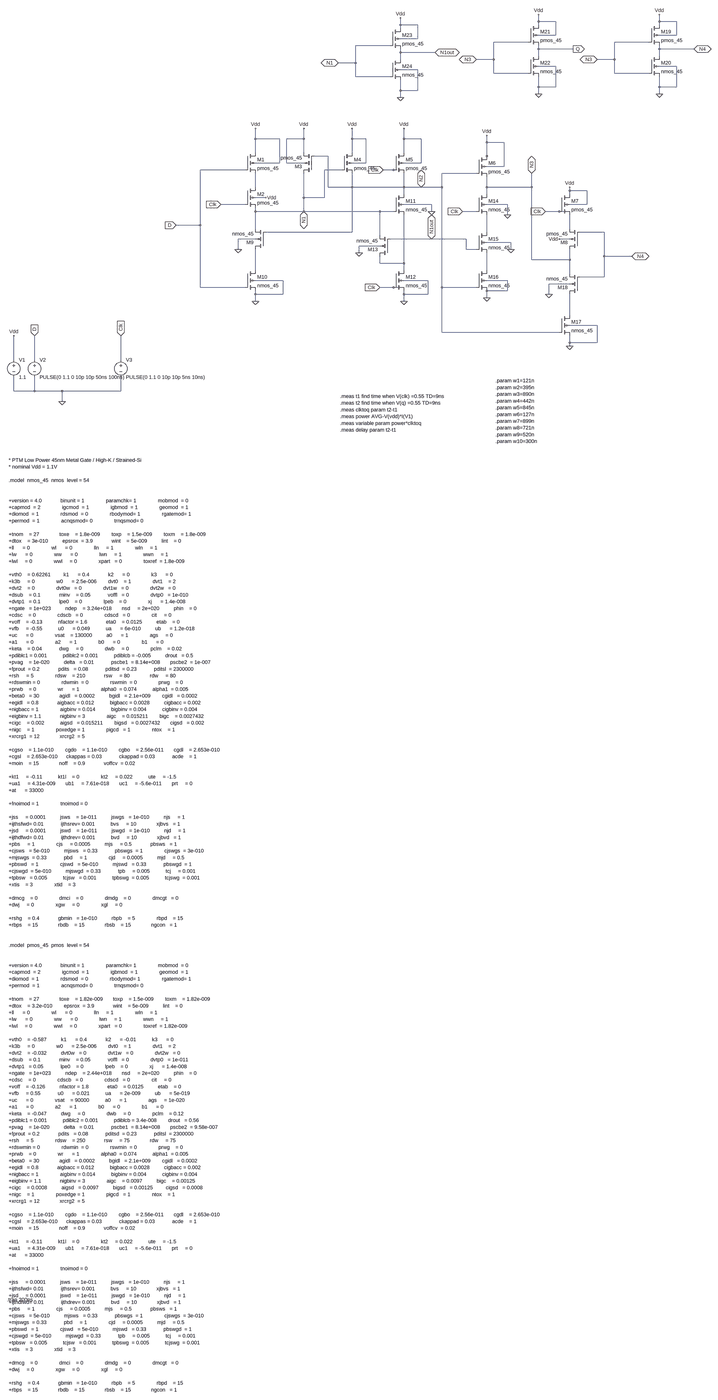
[diagram p0: schematic s2cff.asc, whole sheet]
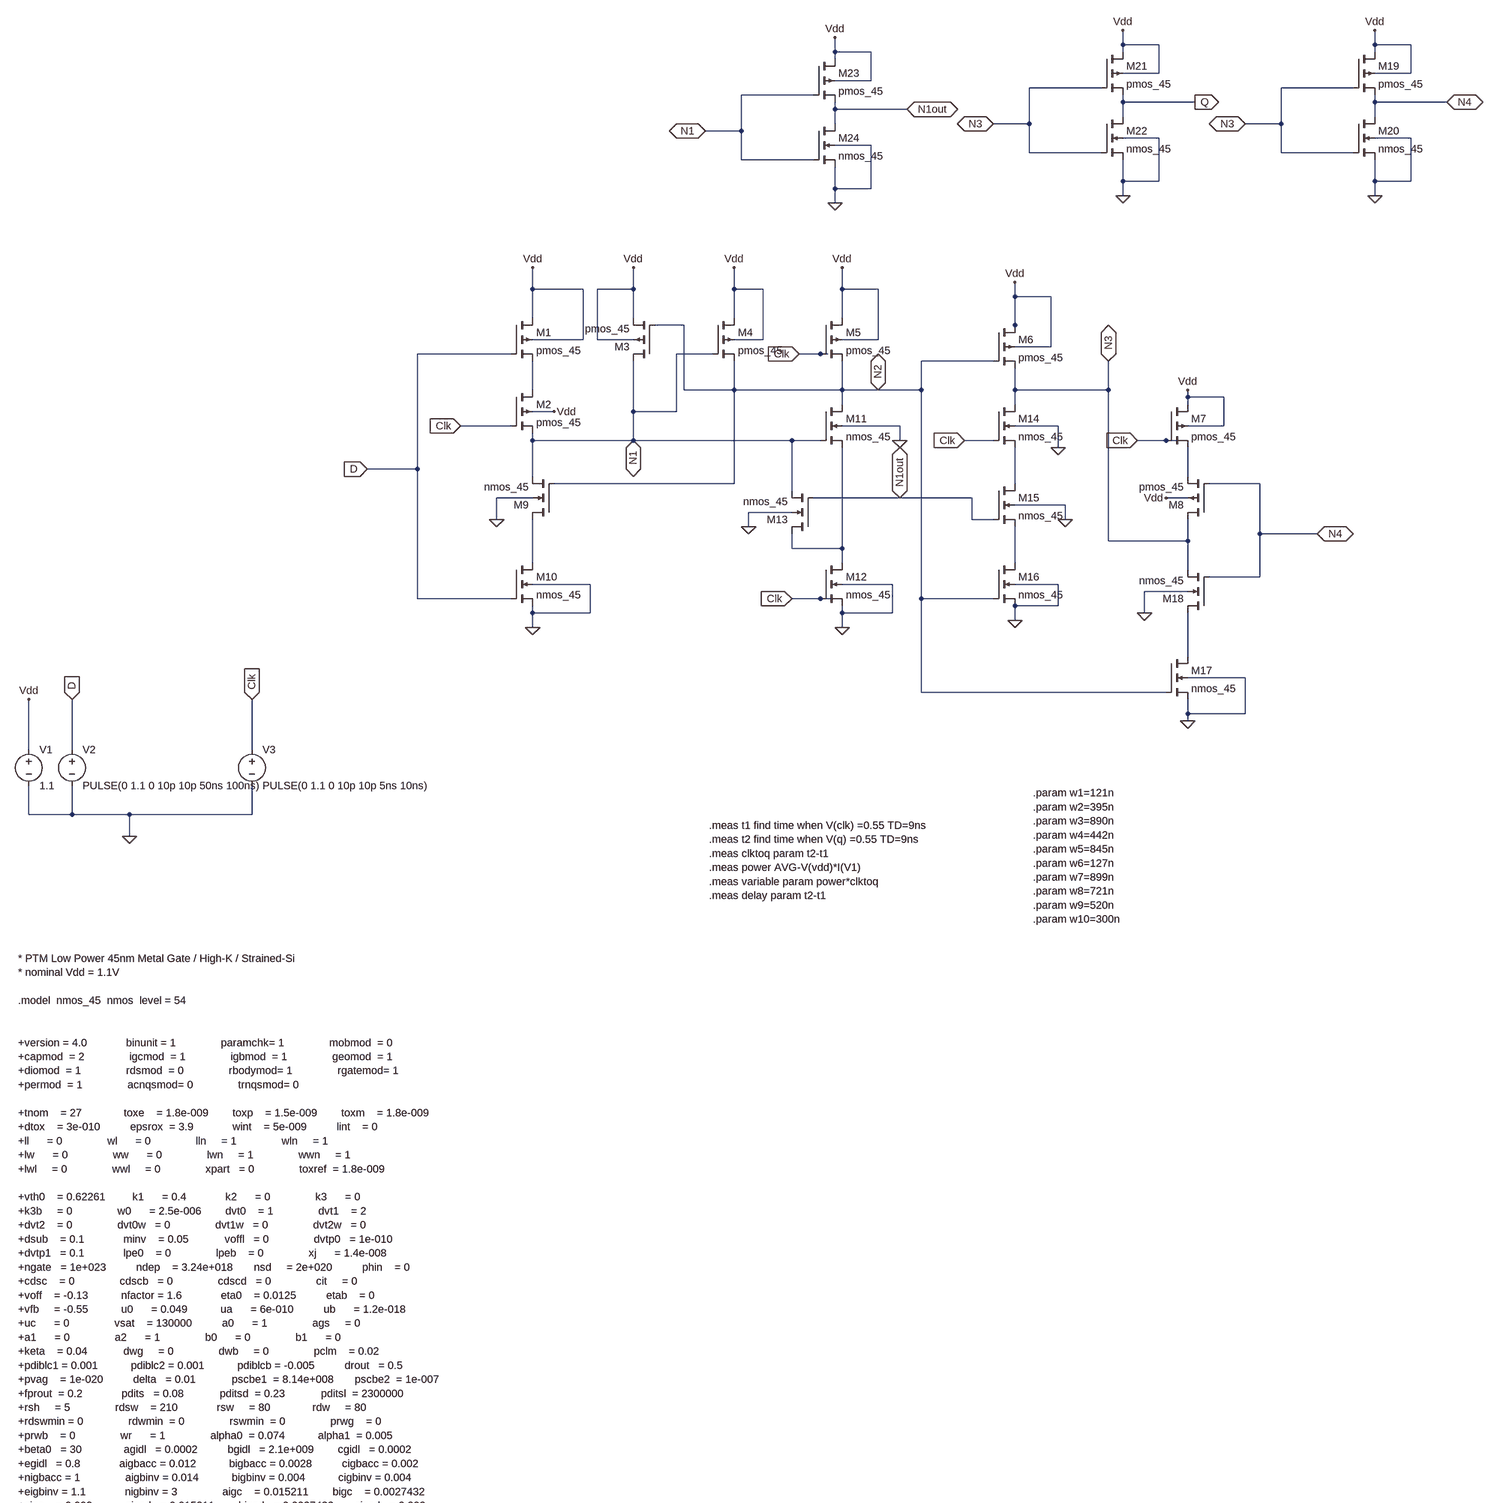
[diagram p1: schematic s2cff.asc, part, row 1 of 2, column 1 of 1]
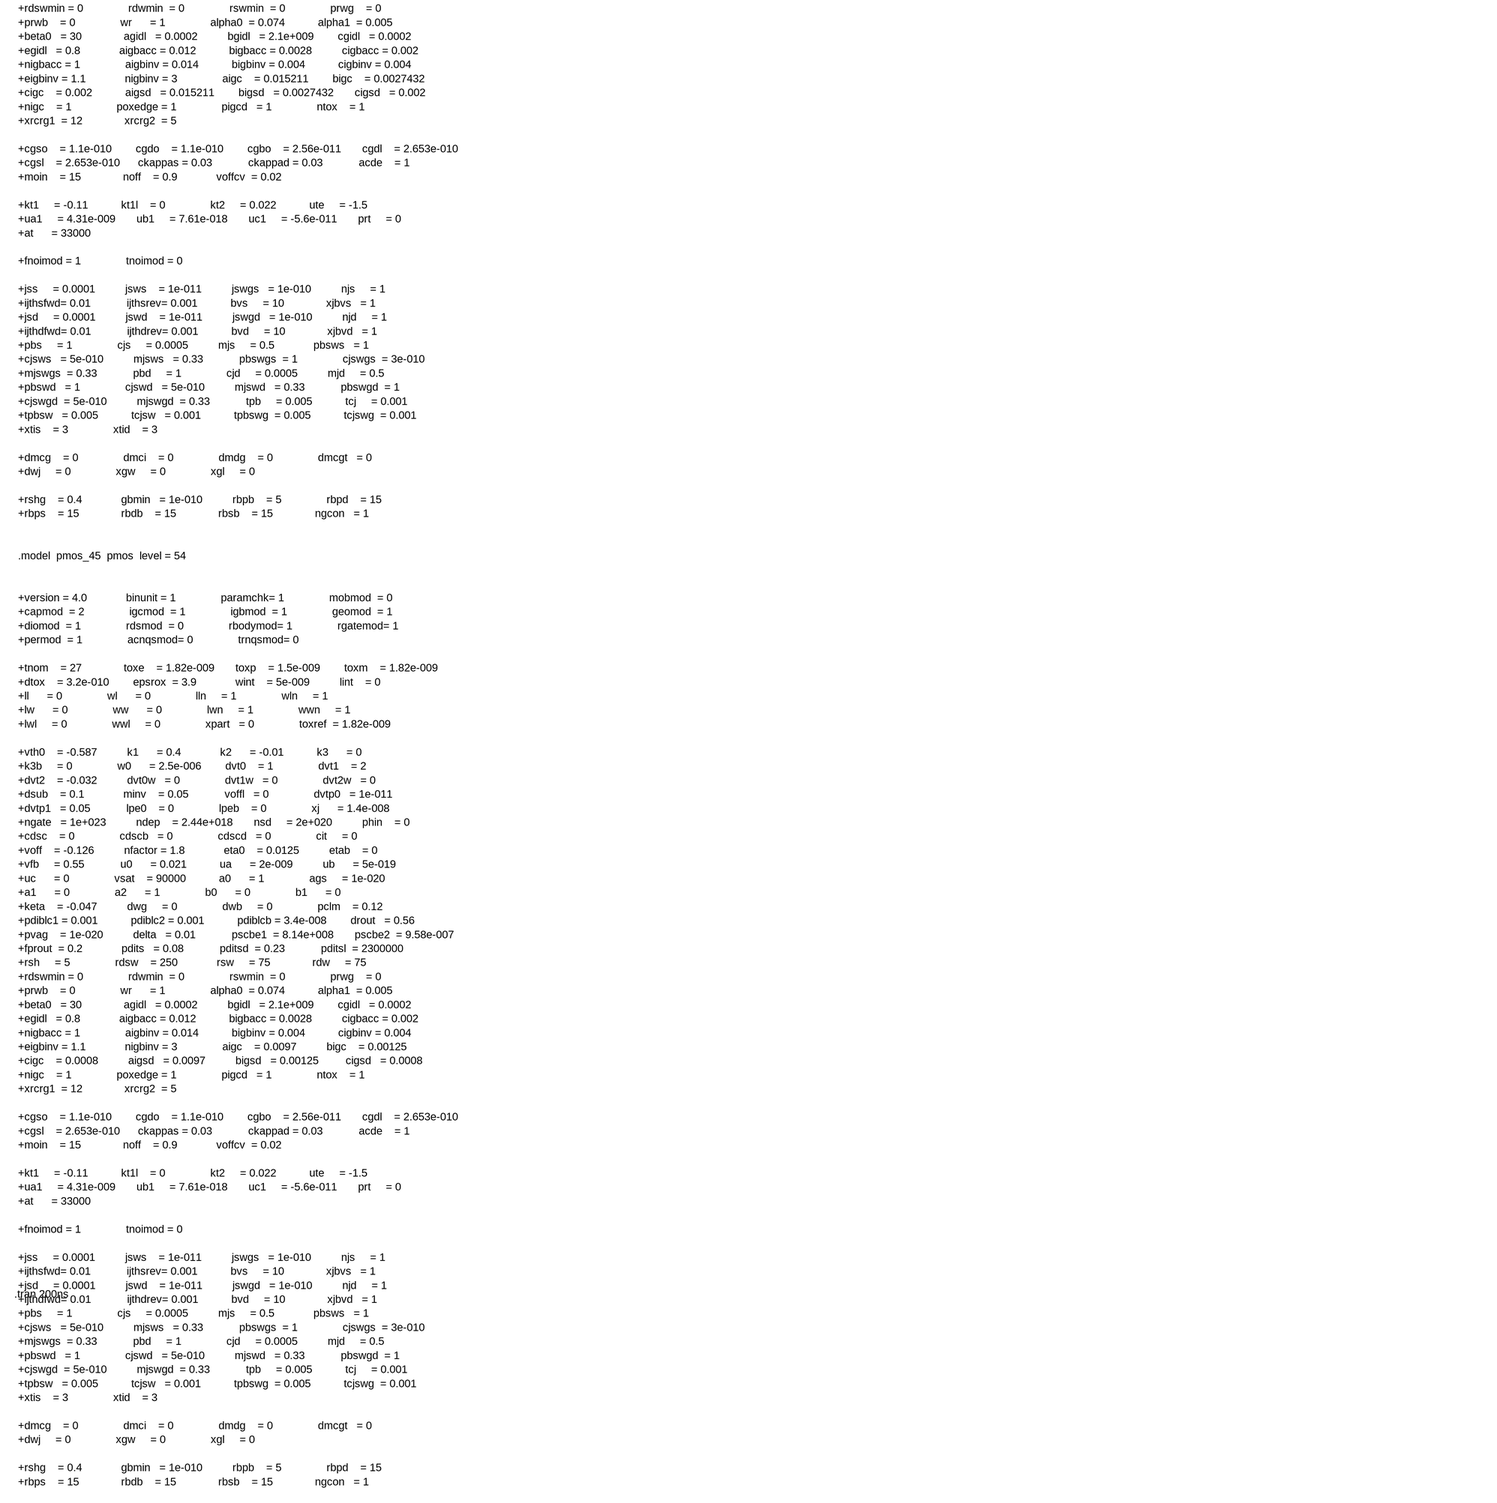
[diagram p2: schematic s2cff.asc, part, row 2 of 2, column 1 of 1]
s2cff.asc, the LTspice schematic file:
Version 4
SHEET 1 4284 5184
WIRE 1760 -752 1760 -784
WIRE 1840 -752 1760 -752
WIRE 2320 -752 2320 -784
WIRE 2400 -752 2320 -752
WIRE 1120 -736 1120 -768
WIRE 1200 -736 1120 -736
WIRE 1760 -736 1760 -752
WIRE 2320 -736 2320 -752
WIRE 1120 -720 1120 -736
WIRE 1840 -688 1840 -752
WIRE 1840 -688 1760 -688
WIRE 2400 -688 2400 -752
WIRE 2400 -688 2320 -688
WIRE 1200 -672 1200 -736
WIRE 1200 -672 1120 -672
WIRE 1712 -656 1552 -656
WIRE 2272 -656 2112 -656
WIRE 1072 -640 912 -640
WIRE 1760 -624 1760 -640
WIRE 1920 -624 1760 -624
WIRE 2320 -624 2320 -640
WIRE 2480 -624 2320 -624
WIRE 1120 -608 1120 -624
WIRE 1280 -608 1120 -608
WIRE 1760 -592 1760 -624
WIRE 2320 -592 2320 -624
WIRE 1120 -576 1120 -608
WIRE 1552 -576 1552 -656
WIRE 1552 -576 1472 -576
WIRE 2112 -576 2112 -656
WIRE 2112 -576 2032 -576
WIRE 912 -560 912 -640
WIRE 912 -560 832 -560
WIRE 1840 -544 1760 -544
WIRE 2400 -544 2320 -544
WIRE 1200 -528 1120 -528
WIRE 1552 -512 1552 -576
WIRE 1712 -512 1552 -512
WIRE 2112 -512 2112 -576
WIRE 2272 -512 2112 -512
WIRE 912 -496 912 -560
WIRE 1072 -496 912 -496
WIRE 1760 -448 1760 -496
WIRE 1840 -448 1840 -544
WIRE 1840 -448 1760 -448
WIRE 2320 -448 2320 -496
WIRE 2400 -448 2400 -544
WIRE 2400 -448 2320 -448
WIRE 1120 -432 1120 -480
WIRE 1200 -432 1200 -528
WIRE 1200 -432 1120 -432
WIRE 1760 -416 1760 -448
WIRE 2320 -416 2320 -448
WIRE 1120 -400 1120 -432
WIRE 448 -208 448 -256
WIRE 560 -208 448 -208
WIRE 672 -208 672 -256
WIRE 672 -208 592 -208
WIRE 896 -208 896 -256
WIRE 960 -208 896 -208
WIRE 1136 -208 1136 -256
WIRE 1216 -208 1136 -208
WIRE 1520 -192 1520 -224
WIRE 1600 -192 1520 -192
WIRE 448 -144 448 -208
WIRE 672 -144 672 -208
WIRE 896 -144 896 -208
WIRE 1136 -144 1136 -208
WIRE 784 -128 720 -128
WIRE 1520 -128 1520 -192
WIRE 1520 -112 1520 -128
WIRE 560 -96 560 -208
WIRE 560 -96 448 -96
WIRE 592 -96 592 -208
WIRE 672 -96 592 -96
WIRE 960 -96 960 -208
WIRE 960 -96 896 -96
WIRE 1216 -96 1216 -208
WIRE 1216 -96 1136 -96
WIRE 1600 -80 1600 -192
WIRE 1600 -80 1520 -80
WIRE 400 -64 192 -64
WIRE 848 -64 768 -64
WIRE 1088 -64 1040 -64
WIRE 1104 -64 1088 -64
WIRE 1472 -48 1312 -48
WIRE 448 16 448 -48
WIRE 784 16 784 -128
WIRE 896 16 896 -48
WIRE 896 16 784 16
WIRE 1136 16 1136 -48
WIRE 1136 16 896 16
WIRE 1216 16 1136 16
WIRE 1312 16 1312 -48
WIRE 1312 16 1216 16
WIRE 1520 16 1520 -32
WIRE 1728 16 1728 -48
WIRE 1728 16 1520 16
WIRE 1904 32 1904 16
WIRE 1984 32 1904 32
WIRE 1136 48 1136 16
WIRE 1520 48 1520 16
WIRE 1904 48 1904 32
WIRE 496 64 448 64
WIRE 672 64 672 -48
WIRE 768 64 768 -64
WIRE 768 64 672 64
WIRE 400 96 288 96
WIRE 1264 96 1136 96
WIRE 1616 96 1520 96
WIRE 1984 96 1984 32
WIRE 1984 96 1904 96
WIRE 448 128 448 112
WIRE 672 128 672 64
WIRE 672 128 448 128
WIRE 1024 128 672 128
WIRE 1088 128 1024 128
WIRE 1264 128 1264 96
WIRE 1472 128 1408 128
WIRE 1856 128 1792 128
WIRE 1904 128 1856 128
WIRE 1616 144 1616 96
WIRE 192 192 192 -64
WIRE 192 192 80 192
WIRE 448 208 448 128
WIRE 1904 208 1904 144
WIRE 896 224 896 16
WIRE 896 224 496 224
WIRE 1520 224 1520 144
WIRE 2064 224 1952 224
WIRE 1024 240 1024 128
WIRE 448 256 368 256
WIRE 1264 256 1072 256
WIRE 1424 256 1264 256
WIRE 1904 256 1856 256
WIRE 1632 272 1520 272
WIRE 1024 288 928 288
WIRE 368 304 368 256
WIRE 1424 304 1424 256
WIRE 1472 304 1424 304
WIRE 1632 304 1632 272
WIRE 928 320 928 288
WIRE 2064 336 2064 224
WIRE 2192 336 2064 336
WIRE 1728 352 1728 16
WIRE 1904 352 1904 304
WIRE 1904 352 1728 352
WIRE 1024 368 1024 336
WIRE 1136 368 1136 144
WIRE 1136 368 1024 368
WIRE 448 400 448 304
WIRE 1136 400 1136 368
WIRE 1520 400 1520 320
WIRE 1904 416 1904 352
WIRE 2064 432 2064 336
WIRE 2064 432 1952 432
WIRE 576 448 448 448
WIRE 1248 448 1136 448
WIRE 1616 448 1520 448
WIRE 1904 464 1808 464
WIRE 192 480 192 192
WIRE 400 480 192 480
WIRE 1088 480 1024 480
WIRE 1136 480 1088 480
WIRE 1312 480 1312 16
WIRE 1472 480 1312 480
WIRE 1616 496 1616 448
WIRE 1616 496 1520 496
WIRE 448 512 448 496
WIRE 576 512 576 448
WIRE 576 512 448 512
WIRE 1136 512 1136 496
WIRE 1248 512 1248 448
WIRE 1248 512 1136 512
WIRE 1808 512 1808 464
WIRE 1520 528 1520 496
WIRE 448 544 448 512
WIRE 1136 544 1136 512
WIRE 1904 608 1904 512
WIRE 2032 656 1904 656
WIRE 1312 688 1312 480
WIRE 1856 688 1312 688
WIRE 1904 736 1904 704
WIRE 2032 736 2032 656
WIRE 2032 736 1904 736
WIRE 1904 752 1904 736
WIRE -672 816 -672 704
WIRE -576 816 -576 704
WIRE -176 816 -176 704
WIRE -672 960 -672 896
WIRE -576 960 -576 896
WIRE -576 960 -672 960
WIRE -448 960 -576 960
WIRE -176 960 -176 896
WIRE -176 960 -448 960
WIRE -448 1008 -448 960
FLAG -576 704 D
IOPIN -576 704 In
FLAG -176 704 Clk
IOPIN -176 704 In
FLAG -672 704 Vdd
FLAG -448 1008 0
FLAG 1760 -784 Vdd
FLAG 1760 -416 0
FLAG 448 -256 Vdd
FLAG 672 -256 Vdd
FLAG 896 -256 Vdd
FLAG 1136 -256 Vdd
FLAG 1520 -224 Vdd
FLAG 80 192 D
IOPIN 80 192 In
FLAG 288 96 Clk
IOPIN 288 96 In
FLAG 1472 -576 N3
IOPIN 1472 -576 BiDir
FLAG 1920 -624 Q
IOPIN 1920 -624 Out
FLAG 1904 16 Vdd
FLAG 448 544 0
FLAG 1136 544 0
FLAG 1904 752 0
FLAG 2320 -784 Vdd
FLAG 2320 -416 0
FLAG 2032 -576 N3
IOPIN 2032 -576 BiDir
FLAG 2480 -624 N4
IOPIN 2480 -624 BiDir
FLAG 1728 -48 N3
IOPIN 1728 -48 BiDir
FLAG 2192 336 N4
IOPIN 2192 336 BiDir
FLAG 1792 128 Clk
IOPIN 1792 128 In
FLAG 1408 128 Clk
IOPIN 1408 128 In
FLAG 1040 -64 Clk
IOPIN 1040 -64 In
FLAG 672 128 N1
IOPIN 672 128 BiDir
FLAG 1216 16 N2
IOPIN 1216 16 BiDir
FLAG 1120 -768 Vdd
FLAG 1120 -400 0
FLAG 832 -560 N1
IOPIN 832 -560 BiDir
FLAG 1280 -608 N1out
IOPIN 1280 -608 BiDir
FLAG 1264 256 N1out
IOPIN 1264 256 BiDir
FLAG 1024 480 Clk
IOPIN 1024 480 In
FLAG 1520 528 0
FLAG 368 304 0
FLAG 928 320 0
FLAG 1264 128 0
FLAG 1616 144 0
FLAG 1632 304 0
FLAG 1808 512 0
FLAG 1856 256 Vdd
FLAG 496 64 Vdd
SYMBOL voltage -672 800 R0
WINDOW 123 0 0 Left 0
WINDOW 39 0 0 Left 0
SYMATTR InstName V1
SYMATTR Value 1.1
SYMBOL voltage -576 800 R0
WINDOW 123 0 0 Left 0
WINDOW 39 0 0 Left 0
SYMATTR InstName V2
SYMATTR Value PULSE(0 1.1 0 10p 10p 50ns 100ns)
SYMBOL voltage -176 800 R0
WINDOW 123 0 0 Left 0
WINDOW 39 0 0 Left 0
SYMATTR InstName V3
SYMATTR Value PULSE(0 1.1 0 10p 10p 5ns 10ns)
SYMBOL pmos4 400 -144 R0
SYMATTR InstName M1
SYMATTR Value pmos_45
SYMATTR Value2 l=45n w=180n
SYMBOL pmos4 400 16 R0
SYMATTR InstName M2
SYMATTR Value pmos_45
SYMATTR Value2 l=45n w=180n
SYMBOL pmos4 720 -48 R180
SYMATTR InstName M3
SYMATTR Value pmos_45
SYMATTR Value2 l=45n w=180n
SYMBOL pmos4 848 -144 R0
SYMATTR InstName M4
SYMATTR Value pmos_45
SYMATTR Value2 l=45n w=180n
SYMBOL pmos4 1088 -144 R0
SYMATTR InstName M5
SYMATTR Value pmos_45
SYMATTR Value2 l=45n w=180n
SYMBOL pmos4 1472 -128 R0
SYMATTR InstName M6
SYMATTR Value pmos_45
SYMATTR Value2 l=45n w=180n
SYMBOL pmos4 1856 48 R0
SYMATTR InstName M7
SYMATTR Value pmos_45
SYMATTR Value2 l=45n w=180n
SYMBOL pmos4 1952 304 R180
SYMATTR InstName M8
SYMATTR Value pmos_45
SYMATTR Value2 l=45n w=180n
SYMBOL nmos4 400 400 R0
SYMATTR InstName M10
SYMATTR Value nmos_45
SYMATTR Value2 l=45n w={w2}
SYMBOL nmos4 1088 48 R0
SYMATTR InstName M11
SYMATTR Value nmos_45
SYMATTR Value2 l=45n w={w3}
SYMBOL nmos4 1088 400 R0
SYMATTR InstName M12
SYMATTR Value nmos_45
SYMATTR Value2 l=45n w={w5}
SYMBOL nmos4 1072 336 R180
SYMATTR InstName M13
SYMATTR Value nmos_45
SYMATTR Value2 l=45n w={w4}
SYMBOL nmos4 1472 48 R0
SYMATTR InstName M14
SYMATTR Value nmos_45
SYMATTR Value2 l=45n w={w6}
SYMBOL nmos4 1472 224 R0
SYMATTR InstName M15
SYMATTR Value nmos_45
SYMATTR Value2 l=45n w={w7}
SYMBOL nmos4 1472 400 R0
SYMATTR InstName M16
SYMATTR Value nmos_45
SYMATTR Value2 l=45n w={w8}
SYMBOL nmos4 1856 608 R0
SYMATTR InstName M17
SYMATTR Value nmos_45
SYMATTR Value2 l=45n w={w10}
SYMBOL nmos4 1952 512 R180
SYMATTR InstName M18
SYMATTR Value nmos_45
SYMATTR Value2 l=45n w={w9}
SYMBOL pmos4 1712 -736 R0
SYMATTR InstName M21
SYMATTR Value pmos_45
SYMATTR Value2 l=45n w=180n
SYMBOL nmos4 1712 -592 R0
SYMATTR InstName M22
SYMATTR Value nmos_45
SYMATTR Value2 l=45n w=90n
SYMBOL nmos4 496 304 R180
SYMATTR InstName M9
SYMATTR Value nmos_45
SYMATTR Value2 l=45n w={w1}
SYMBOL pmos4 2272 -736 R0
SYMATTR InstName M19
SYMATTR Value pmos_45
SYMATTR Value2 l=45n w=180n
SYMBOL nmos4 2272 -592 R0
SYMATTR InstName M20
SYMATTR Value nmos_45
SYMATTR Value2 l=45n w=90n
SYMBOL pmos4 1072 -720 R0
SYMATTR InstName M23
SYMATTR Value pmos_45
SYMATTR Value2 l=45n w=180n
SYMBOL nmos4 1072 -576 R0
SYMATTR InstName M24
SYMATTR Value nmos_45
SYMATTR Value2 l=45n w=90n
TEXT -696 1280 Left 2 !* PTM Low Power 45nm Metal Gate / High-K / Strained-Si\n* nominal Vdd = 1.1V\n \n.model  nmos_45  nmos  level = 54\n \n \n+version = 4.0             binunit = 1               paramchk= 1               mobmod  = 0             \n+capmod  = 2               igcmod  = 1               igbmod  = 1               geomod  = 1             \n+diomod  = 1               rdsmod  = 0               rbodymod= 1               rgatemod= 1             \n+permod  = 1               acnqsmod= 0               trnqsmod= 0             \n \n+tnom    = 27              toxe    = 1.8e-009        toxp    = 1.5e-009        toxm    = 1.8e-009      \n+dtox    = 3e-010          epsrox  = 3.9             wint    = 5e-009          lint    = 0             \n+ll      = 0               wl      = 0               lln     = 1               wln     = 1             \n+lw      = 0               ww      = 0               lwn     = 1               wwn     = 1             \n+lwl     = 0               wwl     = 0               xpart   = 0               toxref  = 1.8e-009      \n \n+vth0    = 0.62261         k1      = 0.4             k2      = 0               k3      = 0             \n+k3b     = 0               w0      = 2.5e-006        dvt0    = 1               dvt1    = 2             \n+dvt2    = 0               dvt0w   = 0               dvt1w   = 0               dvt2w   = 0             \n+dsub    = 0.1             minv    = 0.05            voffl   = 0               dvtp0   = 1e-010        \n+dvtp1   = 0.1             lpe0    = 0               lpeb    = 0               xj      = 1.4e-008      \n+ngate   = 1e+023          ndep    = 3.24e+018       nsd     = 2e+020          phin    = 0             \n+cdsc    = 0               cdscb   = 0               cdscd   = 0               cit     = 0             \n+voff    = -0.13           nfactor = 1.6             eta0    = 0.0125          etab    = 0             \n+vfb     = -0.55           u0      = 0.049           ua      = 6e-010          ub      = 1.2e-018      \n+uc      = 0               vsat    = 130000          a0      = 1               ags     = 0             \n+a1      = 0               a2      = 1               b0      = 0               b1      = 0             \n+keta    = 0.04            dwg     = 0               dwb     = 0               pclm    = 0.02          \n+pdiblc1 = 0.001           pdiblc2 = 0.001           pdiblcb = -0.005          drout   = 0.5           \n+pvag    = 1e-020          delta   = 0.01            pscbe1  = 8.14e+008       pscbe2  = 1e-007        \n+fprout  = 0.2             pdits   = 0.08            pditsd  = 0.23            pditsl  = 2300000       \n+rsh     = 5               rdsw    = 210             rsw     = 80              rdw     = 80            \n+rdswmin = 0               rdwmin  = 0               rswmin  = 0               prwg    = 0             \n+prwb    = 0               wr      = 1               alpha0  = 0.074           alpha1  = 0.005         \n+beta0   = 30              agidl   = 0.0002          bgidl   = 2.1e+009        cgidl   = 0.0002        \n+egidl   = 0.8             aigbacc = 0.012           bigbacc = 0.0028          cigbacc = 0.002         \n+nigbacc = 1               aigbinv = 0.014           bigbinv = 0.004           cigbinv = 0.004         \n+eigbinv = 1.1             nigbinv = 3               aigc    = 0.015211        bigc    = 0.0027432     \n+cigc    = 0.002           aigsd   = 0.015211        bigsd   = 0.0027432       cigsd   = 0.002         \n+nigc    = 1               poxedge = 1               pigcd   = 1               ntox    = 1             \n+xrcrg1  = 12              xrcrg2  = 5             \n \n+cgso    = 1.1e-010        cgdo    = 1.1e-010        cgbo    = 2.56e-011       cgdl    = 2.653e-010    \n+cgsl    = 2.653e-010      ckappas = 0.03            ckappad = 0.03            acde    = 1             \n+moin    = 15              noff    = 0.9             voffcv  = 0.02          \n \n+kt1     = -0.11           kt1l    = 0               kt2     = 0.022           ute     = -1.5          \n+ua1     = 4.31e-009       ub1     = 7.61e-018       uc1     = -5.6e-011       prt     = 0             \n+at      = 33000         \n \n+fnoimod = 1               tnoimod = 0             \n \n+jss     = 0.0001          jsws    = 1e-011          jswgs   = 1e-010          njs     = 1             \n+ijthsfwd= 0.01            ijthsrev= 0.001           bvs     = 10              xjbvs   = 1             \n+jsd     = 0.0001          jswd    = 1e-011          jswgd   = 1e-010          njd     = 1             \n+ijthdfwd= 0.01            ijthdrev= 0.001           bvd     = 10              xjbvd   = 1             \n+pbs     = 1               cjs     = 0.0005          mjs     = 0.5             pbsws   = 1             \n+cjsws   = 5e-010          mjsws   = 0.33            pbswgs  = 1               cjswgs  = 3e-010        \n+mjswgs  = 0.33            pbd     = 1               cjd     = 0.0005          mjd     = 0.5           \n+pbswd   = 1               cjswd   = 5e-010          mjswd   = 0.33            pbswgd  = 1             \n+cjswgd  = 5e-010          mjswgd  = 0.33            tpb     = 0.005           tcj     = 0.001         \n+tpbsw   = 0.005           tcjsw   = 0.001           tpbswg  = 0.005           tcjswg  = 0.001         \n+xtis    = 3               xtid    = 3             \n \n+dmcg    = 0               dmci    = 0               dmdg    = 0               dmcgt   = 0             \n+dwj     = 0               xgw     = 0               xgl     = 0             \n \n+rshg    = 0.4             gbmin   = 1e-010          rbpb    = 5               rbpd    = 15            \n+rbps    = 15              rbdb    = 15              rbsb    = 15              ngcon   = 1             \n \n \n.model  pmos_45  pmos  level = 54\n \n \n+version = 4.0             binunit = 1               paramchk= 1               mobmod  = 0             \n+capmod  = 2               igcmod  = 1               igbmod  = 1               geomod  = 1             \n+diomod  = 1               rdsmod  = 0               rbodymod= 1               rgatemod= 1             \n+permod  = 1               acnqsmod= 0               trnqsmod= 0             \n \n+tnom    = 27              toxe    = 1.82e-009       toxp    = 1.5e-009        toxm    = 1.82e-009     \n+dtox    = 3.2e-010        epsrox  = 3.9             wint    = 5e-009          lint    = 0             \n+ll      = 0               wl      = 0               lln     = 1               wln     = 1             \n+lw      = 0               ww      = 0               lwn     = 1               wwn     = 1             \n+lwl     = 0               wwl     = 0               xpart   = 0               toxref  = 1.82e-009     \n \n+vth0    = -0.587          k1      = 0.4             k2      = -0.01           k3      = 0             \n+k3b     = 0               w0      = 2.5e-006        dvt0    = 1               dvt1    = 2             \n+dvt2    = -0.032          dvt0w   = 0               dvt1w   = 0               dvt2w   = 0             \n+dsub    = 0.1             minv    = 0.05            voffl   = 0               dvtp0   = 1e-011        \n+dvtp1   = 0.05            lpe0    = 0               lpeb    = 0               xj      = 1.4e-008      \n+ngate   = 1e+023          ndep    = 2.44e+018       nsd     = 2e+020          phin    = 0             \n+cdsc    = 0               cdscb   = 0               cdscd   = 0               cit     = 0             \n+voff    = -0.126          nfactor = 1.8             eta0    = 0.0125          etab    = 0             \n+vfb     = 0.55            u0      = 0.021           ua      = 2e-009          ub      = 5e-019        \n+uc      = 0               vsat    = 90000           a0      = 1               ags     = 1e-020        \n+a1      = 0               a2      = 1               b0      = 0               b1      = 0             \n+keta    = -0.047          dwg     = 0               dwb     = 0               pclm    = 0.12          \n+pdiblc1 = 0.001           pdiblc2 = 0.001           pdiblcb = 3.4e-008        drout   = 0.56          \n+pvag    = 1e-020          delta   = 0.01            pscbe1  = 8.14e+008       pscbe2  = 9.58e-007     \n+fprout  = 0.2             pdits   = 0.08            pditsd  = 0.23            pditsl  = 2300000       \n+rsh     = 5               rdsw    = 250             rsw     = 75              rdw     = 75            \n+rdswmin = 0               rdwmin  = 0               rswmin  = 0               prwg    = 0             \n+prwb    = 0               wr      = 1               alpha0  = 0.074           alpha1  = 0.005         \n+beta0   = 30              agidl   = 0.0002          bgidl   = 2.1e+009        cgidl   = 0.0002        \n+egidl   = 0.8             aigbacc = 0.012           bigbacc = 0.0028          cigbacc = 0.002         \n+nigbacc = 1               aigbinv = 0.014           bigbinv = 0.004           cigbinv = 0.004         \n+eigbinv = 1.1             nigbinv = 3               aigc    = 0.0097          bigc    = 0.00125       \n+cigc    = 0.0008          aigsd   = 0.0097          bigsd   = 0.00125         cigsd   = 0.0008        \n+nigc    = 1               poxedge = 1               pigcd   = 1               ntox    = 1             \n+xrcrg1  = 12              xrcrg2  = 5             \n \n+cgso    = 1.1e-010        cgdo    = 1.1e-010        cgbo    = 2.56e-011       cgdl    = 2.653e-010    \n+cgsl    = 2.653e-010      ckappas = 0.03            ckappad = 0.03            acde    = 1             \n+moin    = 15              noff    = 0.9             voffcv  = 0.02          \n \n+kt1     = -0.11           kt1l    = 0               kt2     = 0.022           ute     = -1.5          \n+ua1     = 4.31e-009       ub1     = 7.61e-018       uc1     = -5.6e-011       prt     = 0             \n+at      = 33000         \n \n+fnoimod = 1               tnoimod = 0             \n \n+jss     = 0.0001          jsws    = 1e-011          jswgs   = 1e-010          njs     = 1             \n+ijthsfwd= 0.01            ijthsrev= 0.001           bvs     = 10              xjbvs   = 1             \n+jsd     = 0.0001          jswd    = 1e-011          jswgd   = 1e-010          njd     = 1             \n+ijthdfwd= 0.01            ijthdrev= 0.001           bvd     = 10              xjbvd   = 1             \n+pbs     = 1               cjs     = 0.0005          mjs     = 0.5             pbsws   = 1             \n+cjsws   = 5e-010          mjsws   = 0.33            pbswgs  = 1               cjswgs  = 3e-010        \n+mjswgs  = 0.33            pbd     = 1               cjd     = 0.0005          mjd     = 0.5           \n+pbswd   = 1               cjswd   = 5e-010          mjswd   = 0.33            pbswgd  = 1             \n+cjswgd  = 5e-010          mjswgd  = 0.33            tpb     = 0.005           tcj     = 0.001         \n+tpbsw   = 0.005           tcjsw   = 0.001           tpbswg  = 0.005           tcjswg  = 0.001         \n+xtis    = 3               xtid    = 3             \n \n+dmcg    = 0               dmci    = 0               dmdg    = 0               dmcgt   = 0             \n+dwj     = 0               xgw     = 0               xgl     = 0             \n \n+rshg    = 0.4             gbmin   = 1e-010          rbpb    = 5               rbpd    = 15            \n+rbps    = 15              rbdb    = 15              rbsb    = 15              ngcon   = 1
TEXT -704 5168 Left 2 !.tran 200ns
TEXT 840 984 Left 2 !.meas t1 find time when V(clk) =0.55 TD=9ns\n.meas t2 find time when V(q) =0.55 TD=9ns\n.meas clktoq param t2-t1\n.meas power AVG-V(vdd)*I(V1)\n.meas variable param power*clktoq\n.meas delay param t2-t1
TEXT 1560 912 Left 2 !.param w1=121n\n.param w2=395n\n.param w3=890n\n.param w4=442n\n.param w5=845n\n.param w6=127n\n.param w7=899n\n.param w8=721n\n.param w9=520n\n.param w10=300n

The netlist it stands for:
* s2cff.asc
V1 Vdd 0 1.1
V2 D 0 PULSE(0 1.1 0 10p 10p 50ns 100ns)
V3 Clk 0 PULSE(0 1.1 0 10p 10p 5ns 10ns)
M1 Vdd D N001 Vdd pmos_45 l=45n w=180n
M2 N001 Clk N1 Vdd pmos_45 l=45n w=180n
M3 N1 N2 Vdd Vdd pmos_45 l=45n w=180n
M4 Vdd N1 N2 Vdd pmos_45 l=45n w=180n
M5 Vdd Clk N2 Vdd pmos_45 l=45n w=180n
M6 Vdd N2 N3 Vdd pmos_45 l=45n w=180n
M7 Vdd Clk N002 Vdd pmos_45 l=45n w=180n
M8 N3 N4 N002 Vdd pmos_45 l=45n w=180n
M10 N005 D 0 0 nmos_45 l=45n w={w2}
M11 N2 N1 N004 0 nmos_45 l=45n w={w3}
M12 N004 Clk 0 0 nmos_45 l=45n w={w5}
M13 N004 N1out N1 0 nmos_45 l=45n w={w4}
M14 N3 Clk N003 0 nmos_45 l=45n w={w6}
M15 N003 N1out N006 0 nmos_45 l=45n w={w7}
M16 N006 N2 0 0 nmos_45 l=45n w={w8}
M17 N007 N2 0 0 nmos_45 l=45n w={w10}
M18 N007 N4 N3 0 nmos_45 l=45n w={w9}
M21 Vdd N3 Q Vdd pmos_45 l=45n w=180n
M22 Q N3 0 0 nmos_45 l=45n w=90n
M9 N005 N2 N1 0 nmos_45 l=45n w={w1}
M19 Vdd N3 N4 Vdd pmos_45 l=45n w=180n
M20 N4 N3 0 0 nmos_45 l=45n w=90n
M23 Vdd N1 N1out Vdd pmos_45 l=45n w=180n
M24 N1out N1 0 0 nmos_45 l=45n w=90n
.model NMOS NMOS
.model PMOS PMOS
.lib standard.mos
* PTM Low Power 45nm Metal Gate / High-K / Strained-Si
* nominal Vdd = 1.1V
.model  nmos_45  nmos  level = 54
+version = 4.0             binunit = 1               paramchk= 1               mobmod  = 0
+capmod  = 2               igcmod  = 1               igbmod  = 1               geomod  = 1
+diomod  = 1               rdsmod  = 0               rbodymod= 1               rgatemod= 1
+permod  = 1               acnqsmod= 0               trnqsmod= 0
+tnom    = 27              toxe    = 1.8e-009        toxp    = 1.5e-009        toxm    = 1.8e-009
+dtox    = 3e-010          epsrox  = 3.9             wint    = 5e-009          lint    = 0
+ll      = 0               wl      = 0               lln     = 1               wln     = 1
+lw      = 0               ww      = 0               lwn     = 1               wwn     = 1
+lwl     = 0               wwl     = 0               xpart   = 0               toxref  = 1.8e-009
+vth0    = 0.62261         k1      = 0.4             k2      = 0               k3      = 0
+k3b     = 0               w0      = 2.5e-006        dvt0    = 1               dvt1    = 2
+dvt2    = 0               dvt0w   = 0               dvt1w   = 0               dvt2w   = 0
+dsub    = 0.1             minv    = 0.05            voffl   = 0               dvtp0   = 1e-010
+dvtp1   = 0.1             lpe0    = 0               lpeb    = 0               xj      = 1.4e-008
+ngate   = 1e+023          ndep    = 3.24e+018       nsd     = 2e+020          phin    = 0
+cdsc    = 0               cdscb   = 0               cdscd   = 0               cit     = 0
+voff    = -0.13           nfactor = 1.6             eta0    = 0.0125          etab    = 0
+vfb     = -0.55           u0      = 0.049           ua      = 6e-010          ub      = 1.2e-018
+uc      = 0               vsat    = 130000          a0      = 1               ags     = 0
+a1      = 0               a2      = 1               b0      = 0               b1      = 0
+keta    = 0.04            dwg     = 0               dwb     = 0               pclm    = 0.02
+pdiblc1 = 0.001           pdiblc2 = 0.001           pdiblcb = -0.005          drout   = 0.5
+pvag    = 1e-020          delta   = 0.01            pscbe1  = 8.14e+008       pscbe2  = 1e-007
+fprout  = 0.2             pdits   = 0.08            pditsd  = 0.23            pditsl  = 2300000
+rsh     = 5               rdsw    = 210             rsw     = 80              rdw     = 80
+rdswmin = 0               rdwmin  = 0               rswmin  = 0               prwg    = 0
+prwb    = 0               wr      = 1               alpha0  = 0.074           alpha1  = 0.005
+beta0   = 30              agidl   = 0.0002          bgidl   = 2.1e+009        cgidl   = 0.0002
+egidl   = 0.8             aigbacc = 0.012           bigbacc = 0.0028          cigbacc = 0.002
+nigbacc = 1               aigbinv = 0.014           bigbinv = 0.004           cigbinv = 0.004
+eigbinv = 1.1             nigbinv = 3               aigc    = 0.015211        bigc    = 0.0027432
+cigc    = 0.002           aigsd   = 0.015211        bigsd   = 0.0027432       cigsd   = 0.002
+nigc    = 1               poxedge = 1               pigcd   = 1               ntox    = 1
+xrcrg1  = 12              xrcrg2  = 5
+cgso    = 1.1e-010        cgdo    = 1.1e-010        cgbo    = 2.56e-011       cgdl    = 2.653e-010
+cgsl    = 2.653e-010      ckappas = 0.03            ckappad = 0.03            acde    = 1
+moin    = 15              noff    = 0.9             voffcv  = 0.02
+kt1     = -0.11           kt1l    = 0               kt2     = 0.022           ute     = -1.5
+ua1     = 4.31e-009       ub1     = 7.61e-018       uc1     = -5.6e-011       prt     = 0
+at      = 33000
+fnoimod = 1               tnoimod = 0
+jss     = 0.0001          jsws    = 1e-011          jswgs   = 1e-010          njs     = 1
+ijthsfwd= 0.01            ijthsrev= 0.001           bvs     = 10              xjbvs   = 1
+jsd     = 0.0001          jswd    = 1e-011          jswgd   = 1e-010          njd     = 1
+ijthdfwd= 0.01            ijthdrev= 0.001           bvd     = 10              xjbvd   = 1
+pbs     = 1               cjs     = 0.0005          mjs     = 0.5             pbsws   = 1
+cjsws   = 5e-010          mjsws   = 0.33            pbswgs  = 1               cjswgs  = 3e-010
+mjswgs  = 0.33            pbd     = 1               cjd     = 0.0005          mjd     = 0.5
+pbswd   = 1               cjswd   = 5e-010          mjswd   = 0.33            pbswgd  = 1
+cjswgd  = 5e-010          mjswgd  = 0.33            tpb     = 0.005           tcj     = 0.001
+tpbsw   = 0.005           tcjsw   = 0.001           tpbswg  = 0.005           tcjswg  = 0.001
+xtis    = 3               xtid    = 3
+dmcg    = 0               dmci    = 0               dmdg    = 0               dmcgt   = 0
+dwj     = 0               xgw     = 0               xgl     = 0
+rshg    = 0.4             gbmin   = 1e-010          rbpb    = 5               rbpd    = 15
+rbps    = 15              rbdb    = 15              rbsb    = 15              ngcon   = 1
.model  pmos_45  pmos  level = 54
+version = 4.0             binunit = 1               paramchk= 1               mobmod  = 0
+capmod  = 2               igcmod  = 1               igbmod  = 1               geomod  = 1
+diomod  = 1               rdsmod  = 0               rbodymod= 1               rgatemod= 1
+permod  = 1               acnqsmod= 0               trnqsmod= 0
+tnom    = 27              toxe    = 1.82e-009       toxp    = 1.5e-009        toxm    = 1.82e-009
+dtox    = 3.2e-010        epsrox  = 3.9             wint    = 5e-009          lint    = 0
+ll      = 0               wl      = 0               lln     = 1               wln     = 1
+lw      = 0               ww      = 0               lwn     = 1               wwn     = 1
+lwl     = 0               wwl     = 0               xpart   = 0               toxref  = 1.82e-009
+vth0    = -0.587          k1      = 0.4             k2      = -0.01           k3      = 0
+k3b     = 0               w0      = 2.5e-006        dvt0    = 1               dvt1    = 2
+dvt2    = -0.032          dvt0w   = 0               dvt1w   = 0               dvt2w   = 0
+dsub    = 0.1             minv    = 0.05            voffl   = 0               dvtp0   = 1e-011
+dvtp1   = 0.05            lpe0    = 0               lpeb    = 0               xj      = 1.4e-008
+ngate   = 1e+023          ndep    = 2.44e+018       nsd     = 2e+020          phin    = 0
+cdsc    = 0               cdscb   = 0               cdscd   = 0               cit     = 0
+voff    = -0.126          nfactor = 1.8             eta0    = 0.0125          etab    = 0
+vfb     = 0.55            u0      = 0.021           ua      = 2e-009          ub      = 5e-019
+uc      = 0               vsat    = 90000           a0      = 1               ags     = 1e-020
+a1      = 0               a2      = 1               b0      = 0               b1      = 0
+keta    = -0.047          dwg     = 0               dwb     = 0               pclm    = 0.12
+pdiblc1 = 0.001           pdiblc2 = 0.001           pdiblcb = 3.4e-008        drout   = 0.56
+pvag    = 1e-020          delta   = 0.01            pscbe1  = 8.14e+008       pscbe2  = 9.58e-007
+fprout  = 0.2             pdits   = 0.08            pditsd  = 0.23            pditsl  = 2300000
+rsh     = 5               rdsw    = 250             rsw     = 75              rdw     = 75
+rdswmin = 0               rdwmin  = 0               rswmin  = 0               prwg    = 0
+prwb    = 0               wr      = 1               alpha0  = 0.074           alpha1  = 0.005
+beta0   = 30              agidl   = 0.0002          bgidl   = 2.1e+009        cgidl   = 0.0002
+egidl   = 0.8             aigbacc = 0.012           bigbacc = 0.0028          cigbacc = 0.002
+nigbacc = 1               aigbinv = 0.014           bigbinv = 0.004           cigbinv = 0.004
+eigbinv = 1.1             nigbinv = 3               aigc    = 0.0097          bigc    = 0.00125
+cigc    = 0.0008          aigsd   = 0.0097          bigsd   = 0.00125         cigsd   = 0.0008
+nigc    = 1               poxedge = 1               pigcd   = 1               ntox    = 1
+xrcrg1  = 12              xrcrg2  = 5
+cgso    = 1.1e-010        cgdo    = 1.1e-010        cgbo    = 2.56e-011       cgdl    = 2.653e-010
+cgsl    = 2.653e-010      ckappas = 0.03            ckappad = 0.03            acde    = 1
+moin    = 15              noff    = 0.9             voffcv  = 0.02
+kt1     = -0.11           kt1l    = 0               kt2     = 0.022           ute     = -1.5
+ua1     = 4.31e-009       ub1     = 7.61e-018       uc1     = -5.6e-011       prt     = 0
+at      = 33000
+fnoimod = 1               tnoimod = 0
+jss     = 0.0001          jsws    = 1e-011          jswgs   = 1e-010          njs     = 1
+ijthsfwd= 0.01            ijthsrev= 0.001           bvs     = 10              xjbvs   = 1
+jsd     = 0.0001          jswd    = 1e-011          jswgd   = 1e-010          njd     = 1
+ijthdfwd= 0.01            ijthdrev= 0.001           bvd     = 10              xjbvd   = 1
+pbs     = 1               cjs     = 0.0005          mjs     = 0.5             pbsws   = 1
+cjsws   = 5e-010          mjsws   = 0.33            pbswgs  = 1               cjswgs  = 3e-010
+mjswgs  = 0.33            pbd     = 1               cjd     = 0.0005          mjd     = 0.5
+pbswd   = 1               cjswd   = 5e-010          mjswd   = 0.33            pbswgd  = 1
+cjswgd  = 5e-010          mjswgd  = 0.33            tpb     = 0.005           tcj     = 0.001
+tpbsw   = 0.005           tcjsw   = 0.001           tpbswg  = 0.005           tcjswg  = 0.001
+xtis    = 3               xtid    = 3
+dmcg    = 0               dmci    = 0               dmdg    = 0               dmcgt   = 0
+dwj     = 0               xgw     = 0               xgl     = 0
+rshg    = 0.4             gbmin   = 1e-010          rbpb    = 5               rbpd    = 15
+rbps    = 15              rbdb    = 15              rbsb    = 15              ngcon   = 1
.tran 200ns
.meas t1 find time when V(clk) =0.55 TD=9ns
.meas t2 find time when V(q) =0.55 TD=9ns
.meas clktoq param t2-t1
.meas power AVG-V(vdd)*I(V1)
.meas variable param power*clktoq
.meas delay param t2-t1
.param w1=121n
.param w2=395n
.param w3=890n
.param w4=442n
.param w5=845n
.param w6=127n
.param w7=899n
.param w8=721n
.param w9=520n
.param w10=300n
.backanno
.end